# EAGLE design schem5 (EAGLE 8.4.2)
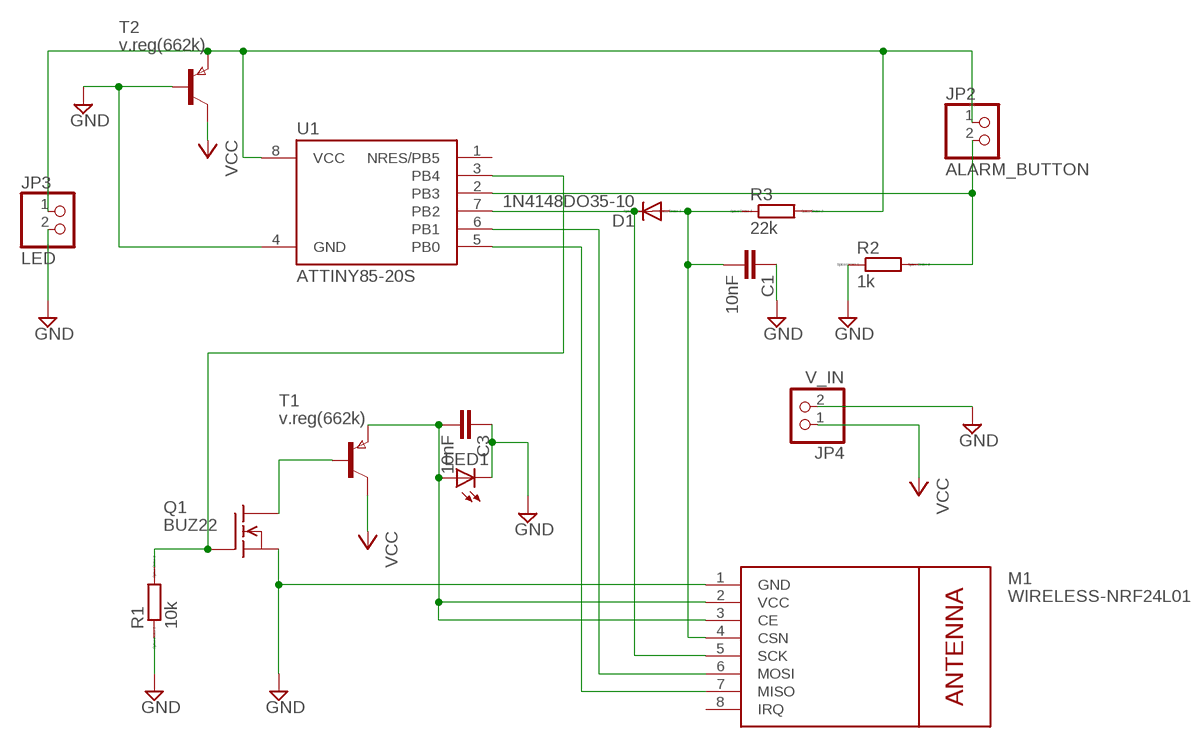
[diagram p0: schematic, sheet 1]

## Parts
C1  10nF  C2.5/2  [C2.5-2]
C3  10nF  C2.5/2  [C2.5-2]
D1  1N4148DO35-10  [DO35-10]
JP2  ALARM_BUTTON  PINHD-1X2  [1X02]
JP3  LED  PINHD-1X2  [1X02]
JP4  V_IN  PINHD-1X2  [1X02]
LED1  LED5MM  [LED5MM]
M1  WIRELESS-NRF24L01  [WIRELESS-NRF24L01]
Q1  BUZ22  [TO220]
R1  10k  R0204/7  [0204/7]
R2  1k  R0204/7  [0204/7]
R3  22k  R0204/7  [0204/7]
T1  v.reg(662k)  PNPSOT323  [SOT323]
T2  v.reg(662k)  PNPSOT323  [SOT323]
U1  ATTINY85-20S  [SOIC8_EIAJ_208MIL]

## Nets
GND: C1.1 C3.1 JP3.2 JP4.2 LED1.K(C) M1.1(GND) Q1.3(S) R1.1 R2.1 T2.2(B) U1.4(GND)
N$1: D1.C M1.5(SCK) U1.7(PB2)
N$2: JP2.2 R2.2 U1.2(PB3)
N$3: Q1.1(G) R1.2 U1.3(PB4)
N$4: Q1.2(D) T1.2(B)
N$5: C1.2 D1.A M1.4(CSN) R3.1
N$6: C3.2 LED1.A M1.2(VCC) M1.3(CE) T1.3(E)
N$7: M1.6(MOSI) U1.6(PB1)
N$8: M1.7(MISO) U1.5(PB0)
VCC: JP4.1 T1.1(C) T2.1(C)
VCC1: JP2.1 JP3.1 R3.2 T2.3(E) U1.8(VCC)
Unconnected: M1.8(IRQ) U1.1(NRES/PB5)

## Library data of the parts
C1 C3 = capacitor-wima:C: CAPACITOR naming: grid - package width
D1 = diode:1N4148: DIODE high speed (Philips)
JP2-JP4 = pinhead:PINHD-1X2: PIN HEADER
LED1 = led:LED: LED OSRAM: - CHIPLED LG R971, LG N971, LY N971, LG Q971, LY Q971, LO R971, LY R971 LH N974, LH R974 LS Q976, LO Q976, LY Q976 LO Q996 - Hyper CHIPLED LW Q18S LB Q993, LB Q99A, LB R99A - SideLED LS A670, LO A670, LY A670, LG A670, LP A670 LB A673, LV A673, LT A673, LW A673 LH A674 LY A675 LS A676, LA A676, LO A676, LY A676, LW A676 LS A679, LY A679, LG A679 - Hyper Micro SIDELED® LS Y876, LA Y876, LO Y876, LY Y876 LT Y87S - SmartLED LW L88C, LW L88S LB L89C, LB L89S, LG L890 LS L89K, LO L89K, LY L89K LS L896, LA L896, LO L896, LY L896 - TOPLED LS T670, LO T670, LY T670, LG T670, LP T670 LSG T670, LSP T670, LSY T670, LOP T670, LYG T670 LG T671, LOG T671, LSG T671 LB T673, LV T673, LT T673, LW T673 LH T674 LS T676, LA T676, LO T676, LY T676, LB T676, LH T676, LSB T676, LW T676 LB T67C, LV T67C, LT T67C, LS T67K, LO T67K, LY T67K, LW E67C LS E67B, LA E67B, LO E67B, LY E67B, LB E67C, LV E67C, LT E67C LW T67C LS T679, LY T679, LG T679 LS T770, LO T770, LY T770, LG T770, LP T770 LB T773, LV T773, LT T773, LW T773 LH T774 LS E675, LA E675, LY E675, LS T675 LS T776, LA T776, LO T776, LY T776, LB T776 LHGB T686 LT T68C, LB T68C - Hyper Mini TOPLED® LB M676 - Mini TOPLED Santana® LG M470 LS M47K, LO M47K, LY M47K Source: http://www.osram.convergy.de LUXEON: - LUMILED® LXK2-PW12-R00, LXK2-PW12-S00, LXK2-PW14-U00, LXK2-PW14-V00 LXK2-PM12-R00, LXK2-PM12-S00, LXK2-PM14-U00 LXK2-PE12-Q00, LXK2-PE12-R00, LXK2-PE12-S00, LXK2-PE14-T00, LXK2-PE14-U00 LXK2-PB12-K00, LXK2-PB12-L00, LXK2-PB12-M00, LXK2-PB14-N00, LXK2-PB14-P00, LXK2-PB14-Q00 LXK2-PR12-L00, LXK2-PR12-M00, LXK2-PR14-Q00, LXK2-PR14-R00 LXK2-PD12-Q00, LXK2-PD12-R00, LXK2-PD12-S00 LXK2-PH12-R00, LXK2-PH12-S00 LXK2-PL12-P00, LXK2-PL12-Q00, LXK2-PL12-R00 Source: www.luxeon.com KINGBRIGHT: KA-3528ASYC Source: www.kingbright.com
M1 = diy-modules:WIRELESS-NRF24L01: 2.4 GHz Wireless Module based on NRF24L01 chip More details available here: http://www.electrodragon.com/w/NRF24L01 Click here to find device on ebay.com <http://www.ebay.com/sch/nrf24l01+arduino>
Q1 = transistor-fet:BUZ22: N-Channel MOSFET not checked
R1-R3 = eagle-ltspice:R: RESISTOR, European symbol; SPICEMODEL: NONE; SPICEPREFIX: R
T1 T2 = zetex:PNPSOT323: PNP TRANSISTOR; MPN: 2DB1689-7; OC_FARNELL: 1710698; OC_NEWARK: 25R5667
U1 = _hhn_attiny25_45_85:ATTINY85*: ATMEL ATtiny 85 Packages: P = PDIP 08 30mil S = SOIC 08 EIAJ 208mil Technologies Note: for complete ordering code (temp. range, finish, tape&reel etc.) see www.atmel.com • Supply Voltage: V = (1.8…5.5)V | [blank] = (2.7…5.5)V • Speed: 10 = 10 MHz | 20 = 20 MHz Author: Dipl.-Ing. FH Rainer Bayer HHN Hochschule Heilbronn (Heilbronn University), rainer.bayer@hs-heilbronn.de Ingenieurbüro ing-rb, mail@ing-rb.de

## Board
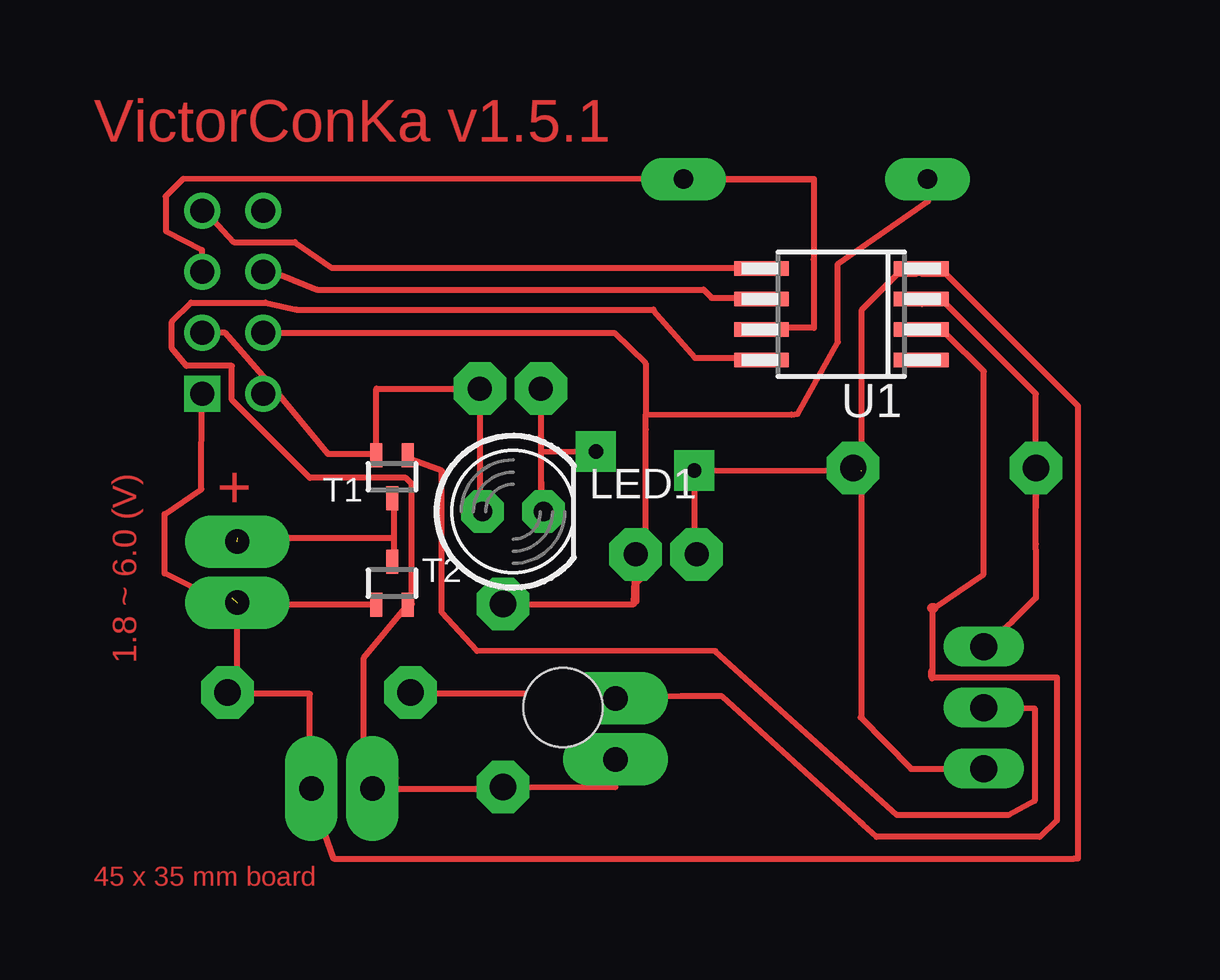
[diagram p1: board, top side]
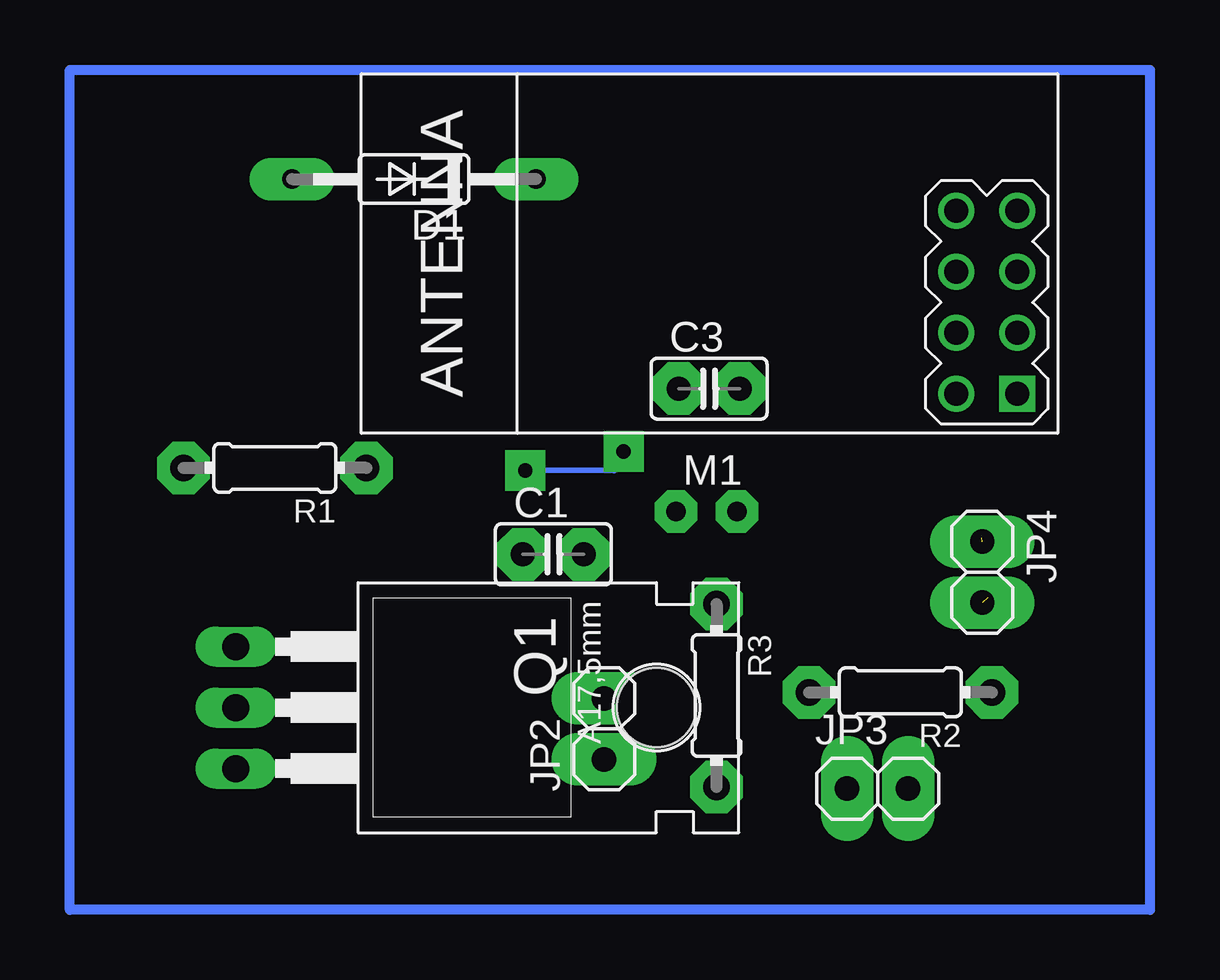
[diagram p2: board, bottom side, seen from below]

No outline drawn. Coordinates in mm, seen from the top.
Copper layers (1*16): Top 0.035mm / dielectric 1.5mm / Bottom 0.035mm
Design rules "default": minimum track width 10mil, minimum drill 24mil, track to track 8mil, track to pad 8mil, pad to pad 8mil, via to via 8mil, smd to smd 8mil, copper to edge 40mil, drill to drill 8mil, minimum pad ring 10mil, minimum via ring 8mil, stop-mask expansion 4mil, vias tented up to drill 0mil, thermal gap 10mil

### Footprints (pad centres in the part's own frame; a part is rotated, then mirrored left to right if it is on the bottom)
C2.5-2 = drill 1 pad 2.184 octagon: 1 -1.27,0; 2 1.27,0
DO35-10 = drill 0.813 pad 1.778 long: A 5.08,0; C -5.08,0
1X02 = drill 1.016 pad 2.184 long: 1 -1.27,0; 2 1.27,0
LED5MM = drill 0.813 pad 1.778 octagon: A -1.27,0; K 1.27,0
WIRELESS-NRF24L01 = drill 1 square: 1 -12.7,6.35 | drill 1: 2 -10.16,6.35; 3 -12.7,3.81; 4 -10.16,3.81; 5 -12.7,1.27; 6 -10.16,1.27; 7 -12.7,-1.27; 8 -10.16,-1.27
TO220 = drill 1.118 long: 1 -2.54,-6.35; 2 0,-6.35; 3 2.54,-6.35 | hole 3.302: 0,11.176
0204/7 = drill 1.1 pad 2.184 octagon: 1 -3.81,0; 2 3.81,0
SOT323 = smd 0.5 x 1: 1 0,0.9; 2 -0.65,-0.9; 3 0.65,-0.9
SOIC8_EIAJ_208MIL = smd 0.6 x 2.286: 1 -1.905,-3.33; 2 -0.635,-3.33; 3 0.635,-3.33; 4 1.905,-3.33; 5 1.905,3.33; 6 0.635,3.33; 7 -0.635,3.33; 8 -1.905,3.33

### Placement (x,y rotation side)
C1  108.85,62.81 0 bottom
C3  102.36,69.72 0 bottom
D1  114.65,78.44 180 bottom
JP2  106.73,55.54 90 bottom
JP3  95.34,53.05 0 bottom
JP4  90.98,62.07 270 bottom
LED1  102.47,64.59 0 top
M1  102.22,75.85 180 bottom
Q1  115.73,56.42 270 bottom
R1  120.45,66.41 180 bottom
R2  94.39,57.06 180 bottom
R3  102.05,56.93 270 bottom
T1  97.43,66.04 180 top
T2  97.43,61.61 0 top
U1  116.15,72.81 90 top

### Tracks (layer width: path | path; a pad name or v marks a point on that pad's centre or on a via)
GND  (via drill 0.6 pad 1.68)  (2 unrouted)
  Top 0.254: 90.75,61 90,61 87.95,62.02 87.95,64.48 89.48,65.52 89.5,69.5 M1.1 | Q1.3 119.06,53.87 116.95,56.02 117,56.02 117,66 117,73 118.5,74.5 119.25,74.5 U1.4 119.5,74.5 120.5,74.5 126,69 126,50.75 126.01,50.14 125.84,50.13 95,50.13 94.25,52.25 94.25,53 JP3.2 94,53.05 94,57 90.58,57 R2.1 90.98,57.06 JP4.2 90.98,60.71 T2.2 | 116.98,66.3 R1.1 | C3.1 103.63,64.71 103.66,64.59 | 103.66,64.59 103.64,67.1 v105.92,67.09 | C1.1 110.02,62.91 v110.02,66.3 117,66.31 | LED1.K 104,64.59 103.66,64.59
  Top 0.406: R1.1 117,66.41 117,66
  Bottom 0.254: v105.92,67.09 106.32,66.31 v110.02,66.3
N$1
  Top 0.254: 115,78.45 109.62,78.43 D1.C | 115,78.45 115,75.1 115,73 115,72.25 113,72.25 U1.7 | 115,78.45 88.72,78.45 87.99,77.73 88,76.28 89.5,75.5 89.5,74.75 M1.5
N$2
  Top 0.254: 119.99,60.56 122.08,61.98 122.09,70.44 120.5,72 119.5,72 U1.2 | 119.94,60.56 119.94,58 | 119.94,58 119.94,57.64 | 119.94,58 119.9,57.97 119.9,57.69 125.13,57.69 125.13,51.73 124.41,51.04 117.62,51.04 117.06,51.55 116.96,51.64 111.18,56.9 109.46,56.9 JP2.2 106.33,56.99 106.01,56.99 105,57 98.06,57 R2.2
  Top 0.406: 119.99,60.56 119.94,60.56
N$3
  Top 0.254: U1.3 119.5,73.25 120.5,73.25 124.25,69.5 124.25,63.25 R1.2 124.25,63 124.25,61 123.25,60 Q1.1
N$4
  Top 0.254: Q1.2 124.2,56.39 124.2,52.53 123.11,51.94 118.48,51.94 110.9,58.78 100.97,58.79 99.5,60.38 99.5,66.29 98.25,66.75 T1.2
N$5
  Top 0.254: 108,68.64 108,70.76 106.7,72.04 M1.4 | 108,68.64 114.07,68.62 114.33,68.66 116,71.65 116,74.91 119.75,77.52 D1.A | R3.1 107.51,60.74 C1.2 107.62,60.85 107.62,61.62 108,62 108,68.01 108,68.64
N$6
  Top 0.254: 92.47,69.74 94.75,67 96.75,67 T1.3 96.78,69.71 C3.2 101.09,64.71 101.09,64.59 LED1.A | 92.47,69.74 90.49,72.04 M1.3 | 92.47,69.74 M1.2
N$7
  Top 0.254: U1.6 112.75,73.5 110.75,73.5 110.41,73.84 94.31,73.84 92.27,74.68 M1.6
N$8
  Top 0.254: U1.5 112.75,74.75 94.92,74.75 93.38,75.82 90.83,75.82 89.75,77 M1.7
N$9
  Bottom 0.406: 84,83 84,48 129,48 129,83 84,83
VCC  (1 unrouted)
  Top 0.254: 97.5,63.5 97.5,65 T1.1 | 97.5,63.5 97.5,62.75 T2.1 | 91,63.5 97.5,63.5
VCC1
  Top 0.254: U1.8 112.75,71 110.05,71 108.32,72.98 108.32,73.01 93.45,73.01 92.16,73.3 89.06,73.3 88.25,72.5 88.25,71.39 88.86,70.66 90.75,70.66 90.75,69.25 94,66 98,66 98.25,65.75 98.25,60.75 T2.3 96.25,58.5 96.25,54.5 97.59,53.48 JP3.1 101.98,53.05 R3.2 106.73,53.11 JP2.1

### Text on the board
Top: VictorConKa v1.5.1 | + | 1.8 ~ 6.0 (V) | 45 x 35 mm board